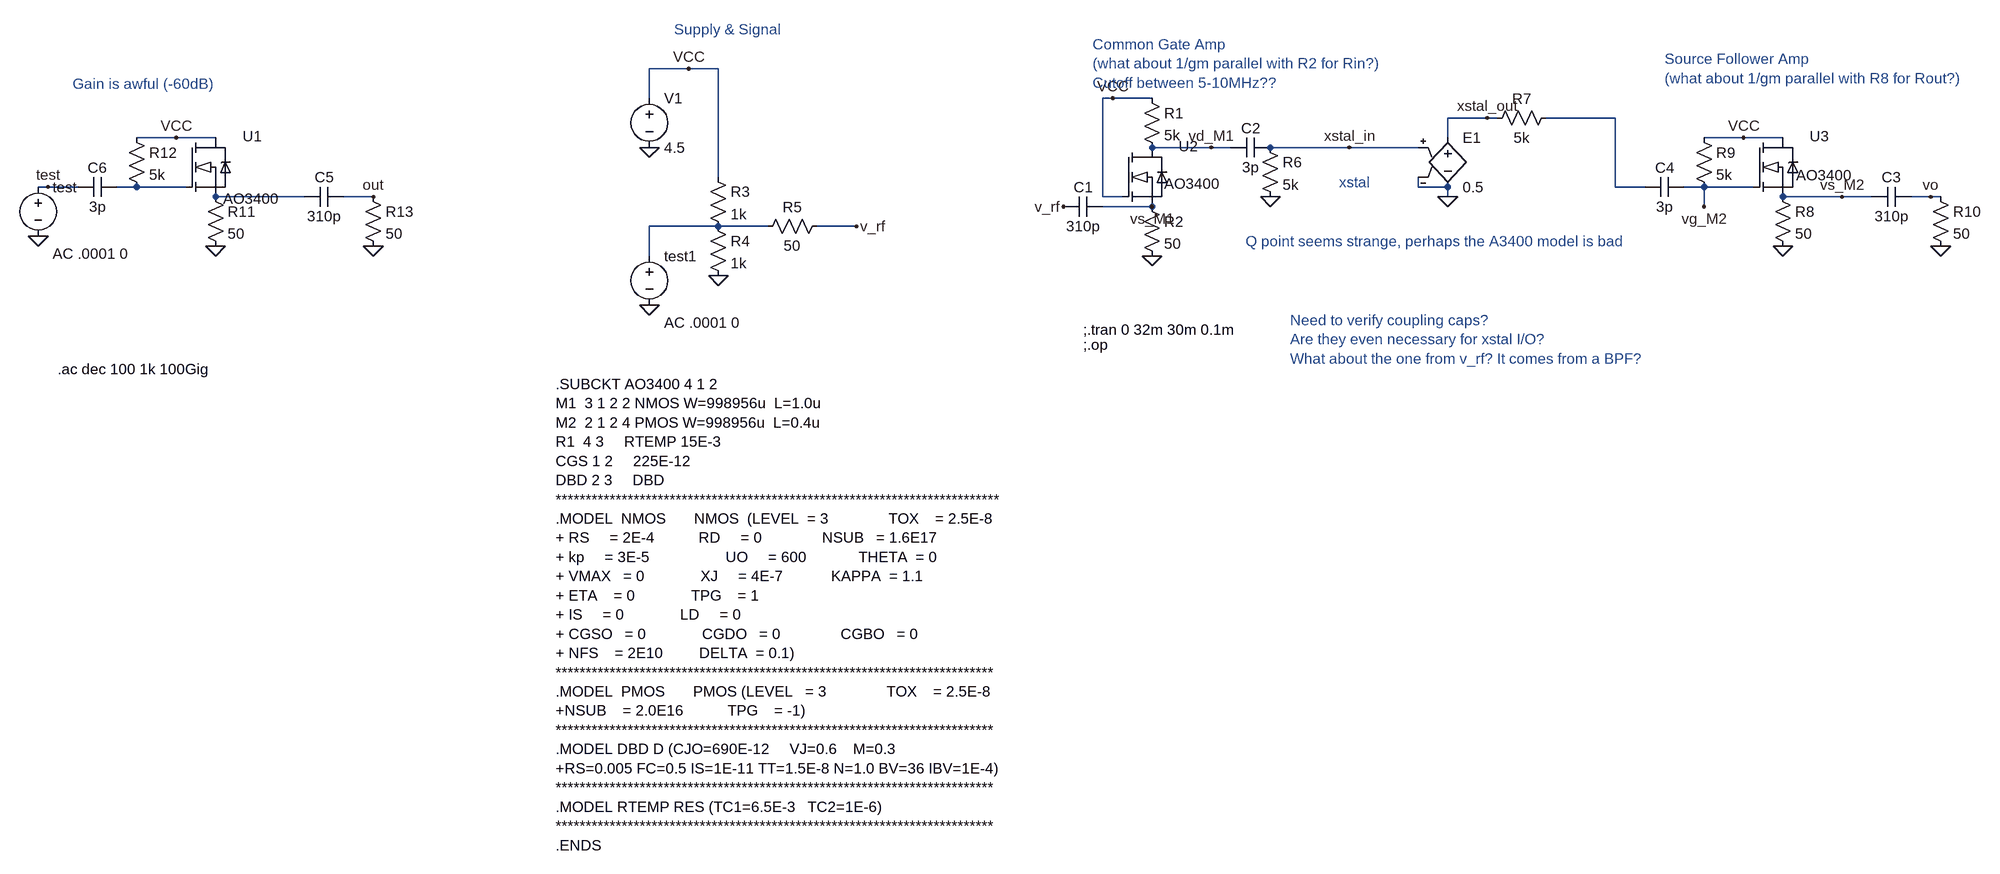
[diagram p0: schematic xstal_ImpedanceMatching.asc]
xstal_ImpedanceMatching.asc, the LTspice schematic file:
Version 4
SHEET 1 1732 1056
WIRE -384 -144 -448 -144
WIRE -336 -144 -384 -144
WIRE -448 -96 -448 -144
WIRE 304 -96 288 -96
WIRE 368 -96 304 -96
WIRE 912 -64 848 -64
WIRE 928 -64 912 -64
WIRE 1120 -64 1008 -64
WIRE -1216 -32 -1280 -32
WIRE -1152 -32 -1216 -32
WIRE 848 -32 848 -64
WIRE 1328 -32 1264 -32
WIRE 1392 -32 1328 -32
WIRE 464 -16 368 -16
WIRE 496 -16 464 -16
WIRE 688 -16 560 -16
WIRE 800 -16 688 -16
WIRE -336 32 -336 -144
WIRE -1424 48 -1440 48
WIRE -1376 48 -1424 48
WIRE -1280 48 -1312 48
WIRE -1200 48 -1280 48
WIRE 800 48 800 32
WIRE 848 48 800 48
WIRE 1120 48 1120 -64
WIRE 1168 48 1120 48
WIRE 1264 48 1232 48
WIRE 1344 48 1264 48
WIRE -1008 64 -1152 64
WIRE -896 64 -944 64
WIRE 288 64 288 -96
WIRE 320 64 288 64
WIRE 848 64 848 48
WIRE 1488 64 1392 64
WIRE 1536 64 1488 64
WIRE 1632 64 1600 64
WIRE 1648 64 1632 64
WIRE 368 80 288 80
WIRE 1264 80 1264 48
WIRE -336 112 -448 112
WIRE -256 112 -336 112
WIRE -112 112 -176 112
WIRE -448 160 -448 112
FLAG -448 -16 0
FLAG -448 240 0
FLAG -112 112 v_rf
FLAG -336 192 0
FLAG -384 -144 VCC
FLAG 224 80 v_rf
FLAG 304 -96 VCC
FLAG 560 64 0
FLAG 368 160 0
FLAG 848 64 0
FLAG 688 -16 xstal_in
FLAG 912 -64 xstal_out
FLAG 1328 -32 VCC
FLAG 1392 144 0
FLAG 1632 64 vo
FLAG 1648 144 0
FLAG 368 80 vs_M1
FLAG 464 -16 vd_M1
FLAG 1264 80 vg_M2
FLAG 1488 64 vs_M2
FLAG -1440 128 0
FLAG -1424 48 test
FLAG -896 144 0
FLAG -896 64 out
FLAG -1216 -32 VCC
FLAG -1152 144 0
SYMBOL voltage -448 -112 R0
WINDOW 123 0 0 Left 0
WINDOW 39 0 0 Left 0
SYMATTR InstName V1
SYMATTR Value 4.5
SYMBOL res 352 -112 R0
SYMATTR InstName R1
SYMATTR Value 5k
SYMBOL res 352 64 R0
SYMATTR InstName R2
SYMATTR Value 50
SYMBOL res -352 16 R0
SYMATTR InstName R3
SYMATTR Value 1k
SYMBOL res -352 96 R0
SYMATTR InstName R4
SYMATTR Value 1k
SYMBOL res -160 96 R90
WINDOW 0 0 56 VBottom 2
WINDOW 3 32 56 VTop 2
SYMATTR InstName R5
SYMATTR Value 50
SYMBOL cap 288 64 R90
WINDOW 0 0 32 VBottom 2
WINDOW 3 32 32 VTop 2
SYMATTR InstName C1
SYMATTR Value 310p
SYMBOL cap 560 -32 R90
WINDOW 0 0 32 VBottom 2
WINDOW 3 32 32 VTop 2
SYMATTR InstName C2
SYMATTR Value 3p
SYMBOL res 544 -32 R0
SYMATTR InstName R6
SYMATTR Value 5k
SYMBOL e 848 -48 R0
SYMATTR InstName E1
SYMATTR Value 0.5
SYMBOL res 1024 -80 R90
WINDOW 0 0 56 VBottom 2
WINDOW 3 32 56 VTop 2
SYMATTR InstName R7
SYMATTR Value 5k
SYMBOL res 1376 48 R0
SYMATTR InstName R8
SYMATTR Value 50
SYMBOL res 1248 -48 R0
SYMATTR InstName R9
SYMATTR Value 5k
SYMBOL cap 1600 48 R90
WINDOW 0 0 32 VBottom 2
WINDOW 3 32 32 VTop 2
SYMATTR InstName C3
SYMATTR Value 310p
SYMBOL cap 1232 32 R90
WINDOW 0 0 32 VBottom 2
WINDOW 3 32 32 VTop 2
SYMATTR InstName C4
SYMATTR Value 3p
SYMBOL res 1632 48 R0
SYMATTR InstName R10
SYMATTR Value 50
SYMBOL voltage -1440 32 R0
WINDOW 123 24 124 Left 2
WINDOW 39 24 152 Left 2
SYMATTR Value2 AC .0001 0
SYMATTR InstName test
SYMATTR Value ""
SYMBOL res -912 48 R0
SYMATTR InstName R13
SYMATTR Value 50
SYMBOL res -1168 48 R0
SYMATTR InstName R11
SYMATTR Value 50
SYMBOL res -1296 -48 R0
SYMATTR InstName R12
SYMATTR Value 5k
SYMBOL cap -944 48 R90
WINDOW 0 0 32 VBottom 2
WINDOW 3 32 32 VTop 2
SYMATTR InstName C5
SYMATTR Value 310p
SYMBOL cap -1312 32 R90
WINDOW 0 0 32 VBottom 2
WINDOW 3 32 32 VTop 2
SYMATTR InstName C6
SYMATTR Value 3p
SYMBOL AO3400 -1120 32 R0
SYMATTR InstName U1
SYMBOL voltage -448 144 R0
WINDOW 123 24 124 Left 2
WINDOW 39 24 152 Left 2
SYMATTR Value2 AC .0001 0
SYMATTR InstName test1
SYMATTR Value ""
SYMBOL AO3400 400 48 R0
WINDOW 3 32 -21 Top 2
SYMATTR InstName U2
SYMBOL AO3400 1424 32 R0
WINDOW 3 34 -19 Top 2
SYMATTR InstName U3
TEXT 256 280 Left 2 !;.tran 0 32m 30m 0.1m
TEXT 272 -184 Left 2 ;Common Gate Amp\n(what about 1/gm parallel with R2 for Rin?)\nCutoff between 5-10MHz??
TEXT 1200 -160 Left 2 ;Source Follower Amp\n(what about 1/gm parallel with R8 for Rout?)
TEXT 672 40 Left 2 ;xstal
TEXT 592 264 Left 2 ;Need to verify coupling caps?\nAre they even necessary for xstal I/O?\nWhat about the one from v_rf? It comes from a BPF?
TEXT -408 -208 Left 2 ;Supply & Signal
TEXT 256 304 Left 2 !;.op
TEXT -1408 344 Left 2 !.ac dec 100 1k 100Gig
TEXT -600 368 Left 2 !.SUBCKT AO3400 4 1 2\nM1  3 1 2 2 NMOS W=998956u  L=1.0u \nM2  2 1 2 4 PMOS W=998956u  L=0.4u\nR1  4 3     RTEMP 15E-3\nCGS 1 2     225E-12\nDBD 2 3     DBD\n**************************************************************************\n.MODEL  NMOS       NMOS  (LEVEL  = 3               TOX    = 2.5E-8\n+ RS     = 2E-4           RD     = 0               NSUB   = 1.6E17  \n+ kp     = 3E-5                   UO     = 600             THETA  = 0\n+ VMAX   = 0              XJ     = 4E-7            KAPPA  = 1.1\n+ ETA    = 0              TPG    = 1  \n+ IS     = 0              LD     = 0                           \n+ CGSO   = 0              CGDO   = 0               CGBO   = 0 \n+ NFS    = 2E10         DELTA  = 0.1)\n*************************************************************************\n.MODEL  PMOS       PMOS (LEVEL   = 3               TOX    = 2.5E-8\n+NSUB    = 2.0E16           TPG    = -1)   \n*************************************************************************\n.MODEL DBD D (CJO=690E-12     VJ=0.6    M=0.3\n+RS=0.005 FC=0.5 IS=1E-11 TT=1.5E-8 N=1.0 BV=36 IBV=1E-4)\n*************************************************************************\n.MODEL RTEMP RES (TC1=6.5E-3   TC2=1E-6)\n*************************************************************************\n.ENDS
TEXT -1384 -120 Left 2 ;Gain is awful (-60dB)
TEXT 520 136 Left 2 ;Q point seems strange, perhaps the A3400 model is bad

The netlist it stands for:
* xstal_ImpedanceMatching.asc
V1 VCC 0 4.5
R1 VCC vd_M1 5k
R2 vs_M1 0 50
R3 VCC N004 1k
R4 N004 0 1k
R5 v_rf N004 50
C1 vs_M1 v_rf 310p
C2 xstal_in vd_M1 3p
R6 xstal_in 0 5k
E1 xstal_out 0 xstal_in 0 0.5
R7 N001 xstal_out 5k
R8 vs_M2 0 50
R9 VCC vg_M2 5k
C3 vo vs_M2 310p
C4 vg_M2 N001 3p
R10 vo 0 50
V§test test 0 AC .0001 0
R13 out 0 50
R11 N003 0 50
R12 VCC N002 5k
C5 out N003 310p
C6 N002 test 3p
XU1 N002 VCC N003 AO3400  ; pins 4 1 2
V§test1 N004 0 AC .0001 0
XU2 VCC vd_M1 vs_M1 AO3400  ; pins 4 1 2
XU3 vg_M2 VCC vs_M2 AO3400  ; pins 4 1 2
;.tran 0 32m 30m 0.1m
* Common Gate Amp
* (what about 1/gm parallel with R2 for Rin?)
* Cutoff between 5-10MHz??
* Source Follower Amp
* (what about 1/gm parallel with R8 for Rout?)
* xstal
* Need to verify coupling caps?
* Are they even necessary for xstal I/O?
* What about the one from v_rf? It comes from a BPF?
* Supply & Signal
;.op
.ac dec 100 1k 100Gig
.SUBCKT AO3400 4 1 2
M1  3 1 2 2 NMOS W=998956u  L=1.0u
M2  2 1 2 4 PMOS W=998956u  L=0.4u
R1  4 3     RTEMP 15E-3
CGS 1 2     225E-12
DBD 2 3     DBD
**************************************************************************
.MODEL  NMOS       NMOS  (LEVEL  = 3               TOX    = 2.5E-8
+ RS     = 2E-4           RD     = 0               NSUB   = 1.6E17
+ kp     = 3E-5                   UO     = 600             THETA  = 0
+ VMAX   = 0              XJ     = 4E-7            KAPPA  = 1.1
+ ETA    = 0              TPG    = 1
+ IS     = 0              LD     = 0
+ CGSO   = 0              CGDO   = 0               CGBO   = 0
+ NFS    = 2E10         DELTA  = 0.1)
*************************************************************************
.MODEL  PMOS       PMOS (LEVEL   = 3               TOX    = 2.5E-8
+NSUB    = 2.0E16           TPG    = -1)
*************************************************************************
.MODEL DBD D (CJO=690E-12     VJ=0.6    M=0.3
+RS=0.005 FC=0.5 IS=1E-11 TT=1.5E-8 N=1.0 BV=36 IBV=1E-4)
*************************************************************************
.MODEL RTEMP RES (TC1=6.5E-3   TC2=1E-6)
*************************************************************************
.ENDS
* Gain is awful (-60dB)
* Q point seems strange, perhaps the A3400 model is bad
.backanno
.end